# EAGLE design UnoBot (EAGLE 9.6.2)
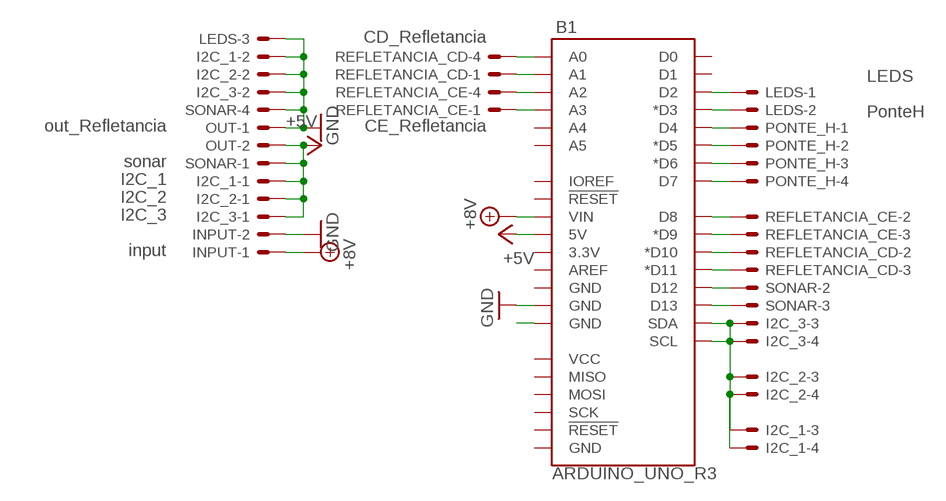
[diagram p0: schematic, sheet 1]

## Parts
B1  ARDUINO_UNO_R3  [ARDUINO_R3]
I2C_1  I2C_1  JST-XH-04-PIN-LONG-PAD  [JST-XH-04-PACKAGE-LONG-PAD]
I2C_2  I2C_2  JST-XH-04-PIN-LONG-PAD  [JST-XH-04-PACKAGE-LONG-PAD]
I2C_3  I2C_3  JST-XH-04-PIN-LONG-PAD  [JST-XH-04-PACKAGE-LONG-PAD]
INPUT  input  JST-XH-02-PIN-LONG-PAD  [JST-XH-02-PACKAGE-LONG-PAD]
LEDS  LEDS  JST-XH-03-PIN-LONG-PAD  [JST-XH-03-PACKAGE-LONG-PAD]
OUT  out_Refletancia  JST-XH-02-PIN-LONG-PAD  [JST-XH-02-PACKAGE-LONG-PAD]
PONTE_H  PonteH  JST-XH-04-PIN-LONG-PAD  [JST-XH-04-PACKAGE-LONG-PAD]
REFLETANCIA_CD  CD_Refletancia  JST-XH-04-PIN-LONG-PAD  [JST-XH-04-PACKAGE-LONG-PAD]
REFLETANCIA_CE  CE_Refletancia  JST-XH-04-PIN-LONG-PAD  [JST-XH-04-PACKAGE-LONG-PAD]
SONAR  sonar  JST-XH-04-PIN-LONG-PAD  [JST-XH-04-PACKAGE-LONG-PAD]

## Nets
+5V: B1.5V I2C_1.1 I2C_2.1 I2C_3.1 OUT.2 SONAR.1
+8V: B1.VIN INPUT.1
GND: B1.GND@3(GND) I2C_1.2 I2C_2.2 I2C_3.2 INPUT.2 LEDS.3 OUT.1 SONAR.4
N$1: B1.D4 PONTE_H.1
N$2: B1.D5(*D5) PONTE_H.2
N$3: B1.D6(*D6) PONTE_H.3
N$4: B1.D7 PONTE_H.4
N$5: B1.A0 REFLETANCIA_CD.4
N$6: B1.A1 REFLETANCIA_CD.1
N$7: B1.A2 REFLETANCIA_CE.4
N$8: B1.A3 REFLETANCIA_CE.1
N$9: B1.D8 REFLETANCIA_CE.2
N$10: B1.D9(*D9) REFLETANCIA_CE.3
N$11: B1.D10(*D10) REFLETANCIA_CD.2
N$12: B1.D11(*D11) REFLETANCIA_CD.3
N$13: B1.D13 SONAR.3
N$14: B1.SDA I2C_1.3 I2C_2.3 I2C_3.3
N$15: B1.D12 SONAR.2
N$16: B1.SCL I2C_1.4 I2C_2.4 I2C_3.4
N$17: B1.GND@2(GND)
N$18: B1.D2 LEDS.1
N$19: B1.D3(*D3) LEDS.2
Unconnected: B1.3.3V B1.A4 B1.A5 B1.AREF B1.D0 B1.D1 B1.GND@1(GND) B1.GND@4(GND) B1.IOREF B1.MISO B1.MOSI B1.RESET@1(!RESET!) B1.RESET@2(!RESET!) B1.SCK B1.VCC

## Library data of the parts
B1 = SparkFun-Boards:ARDUINO_UNO_R3: Arduino R3 Footprint with SPI header Arduino Uno R3 Compatible Footprint. Matches PCB size of the original board. SparkFun Products: SAMD21 Dev Breakout <https://www.sparkfun.com/products/13672> RedBoard <https://www.sparkfun.com/products/12757> R3 Stackable Headers <https://www.sparkfun.com/products/11417>
I2C_1-I2C_3 PONTE_H REFLETANCIA_CD REFLETANCIA_CE SONAR = Rembrandt Electronics - JST XH Connectors v1-0:JST-XH-04-PIN: JST XH Connector 2 Pin Wire to board connector. Pitch: 2,54 mm, (0.100") Number of pins: 4 Created by Rembrandt Electronics www.rembrandtelectronics.com
INPUT OUT = Rembrandt Electronics - JST XH Connectors v1-0:JST-XH-02-PIN: JST XH Connector 2 Pin Wire to board connector. Pitch: 2,54 mm, (0.100") Number of pins: 2 Created by Rembrandt Electronics www.rembrandtelectronics.com
LEDS = Rembrandt Electronics - JST XH Connectors v1-0:JST-XH-03-PIN: JST XH Connector 2 Pin Wire to board connector. Pitch: 2,54 mm, (0.100") Number of pins: 3 Created by Rembrandt Electronics www.rembrandtelectronics.com

## Board
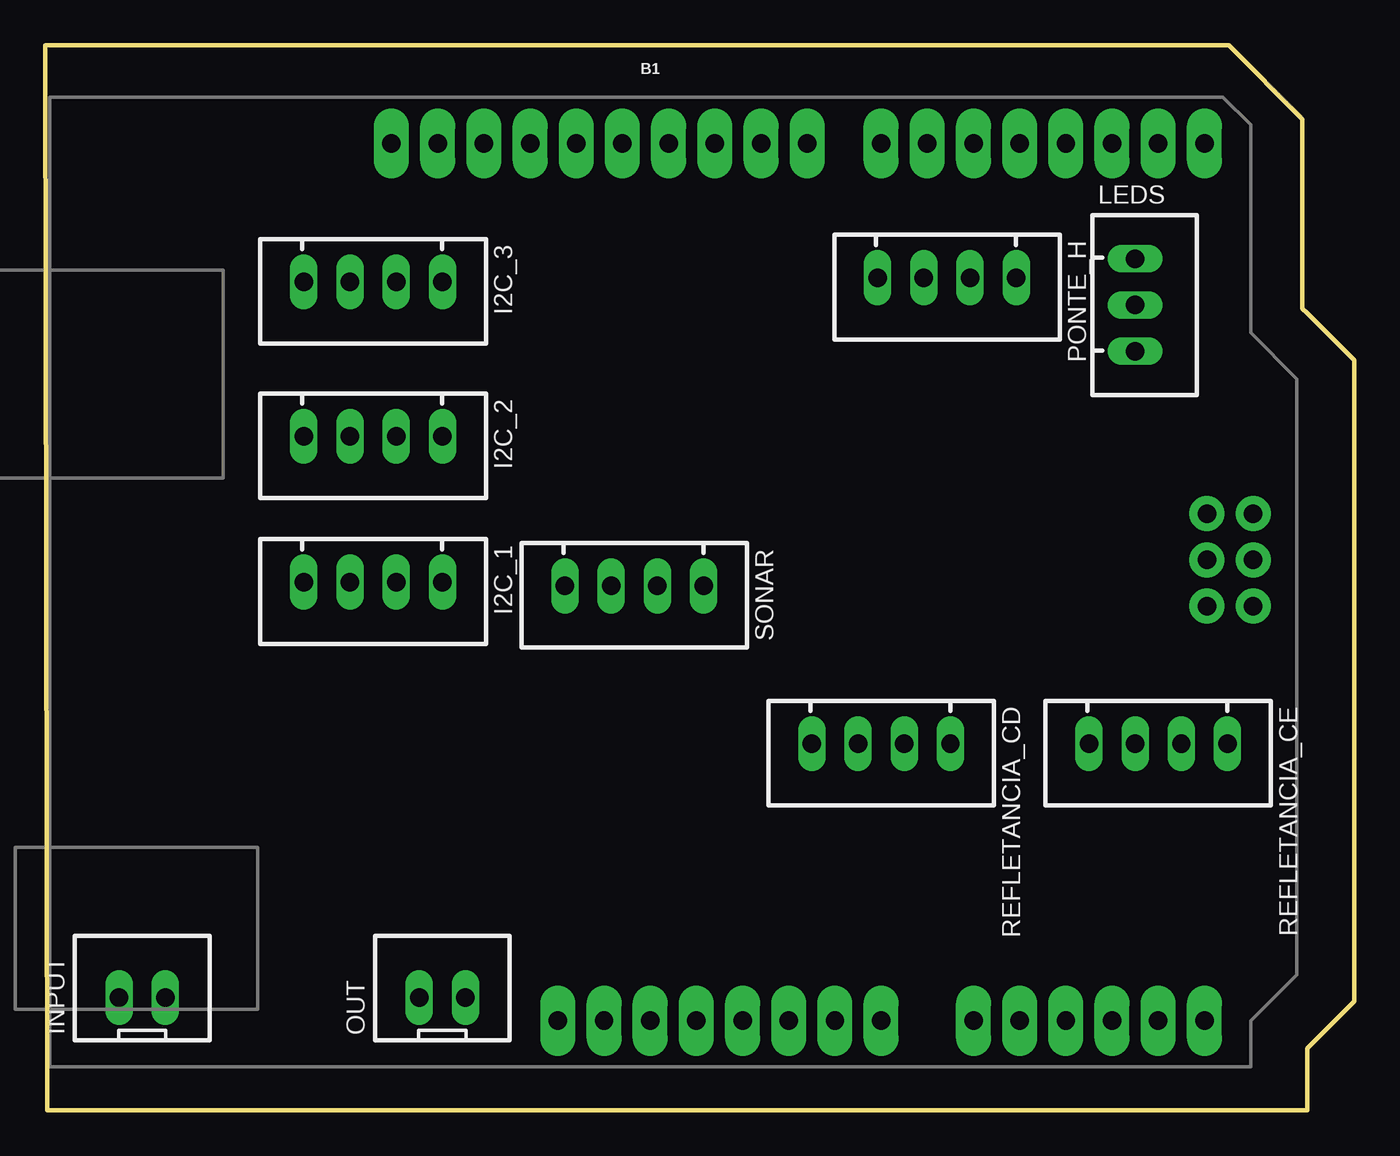
[diagram p1: board, top side]
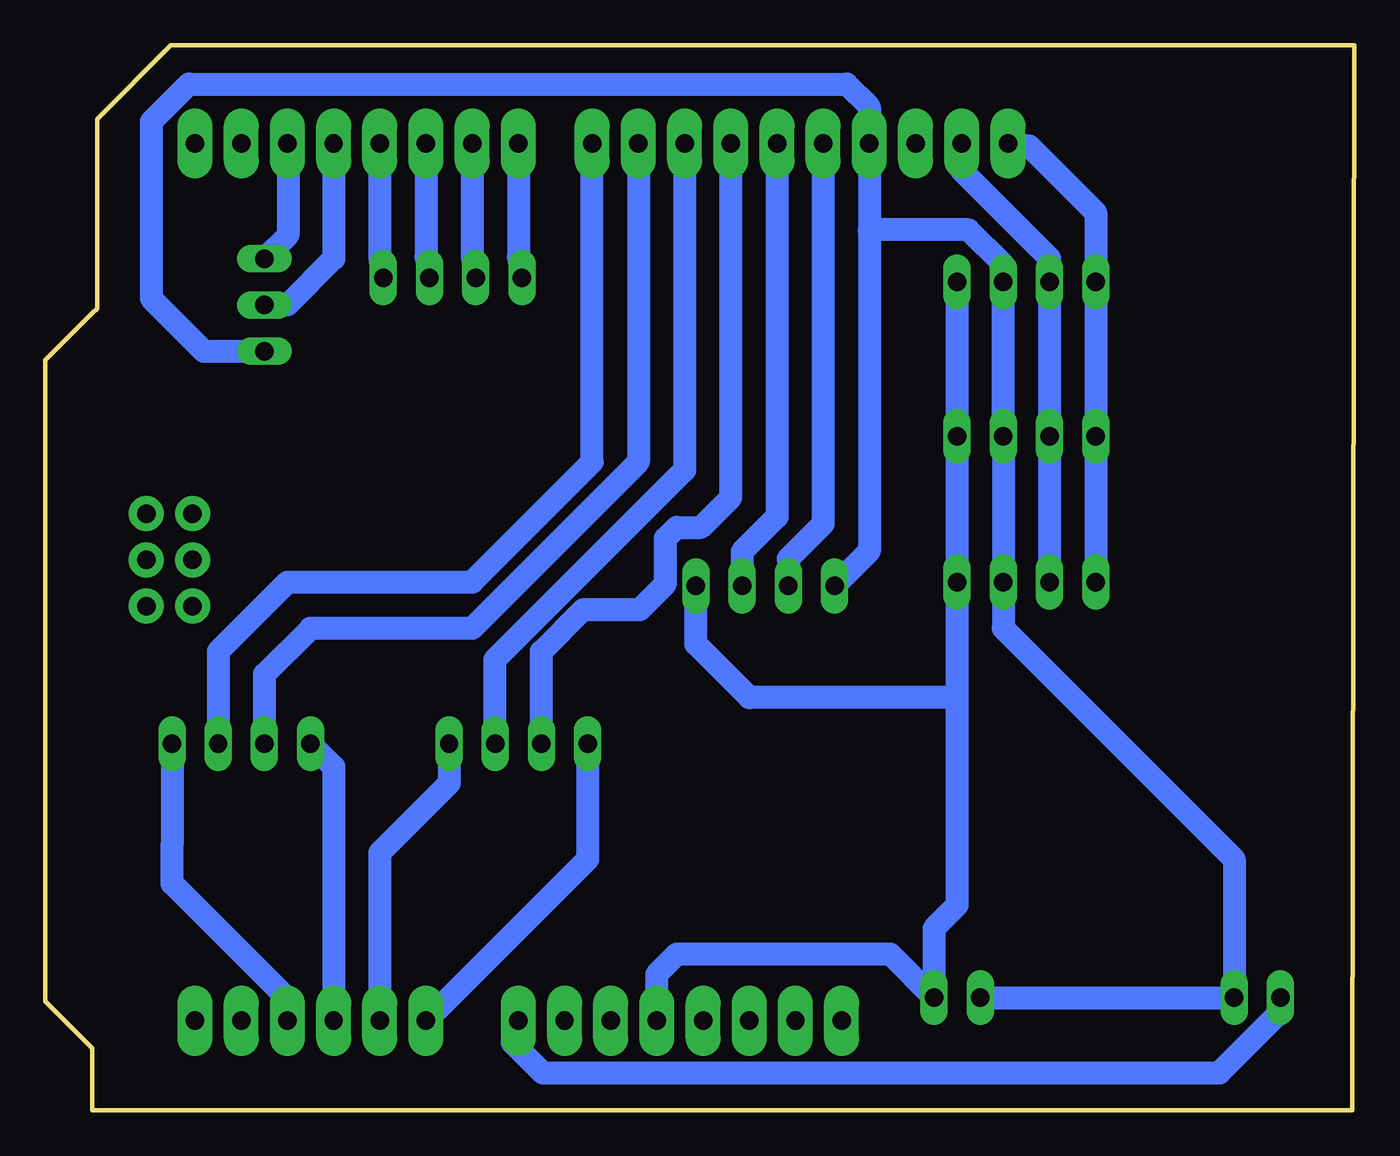
[diagram p2: board, bottom side, seen from below]

Size 71.97 x 58.57 mm. Coordinates in mm from the lower left corner, seen from the top.
Outline: 0.01,58.57 0,58.57
Outline: 0,58.57 65.07,58.57 69.13,54.52 69.13,44.11 69.39,43.84 71.97,41.26 71.97,5.99 69.39,3.42 69.39,3.25 69.39,0.01 68.76,0 0.99,0
Outline: 0.99,0 0.14,0
Outline: 0,58.57 0.1,0 0.99,0
Copper layers (1*16): Top 0.035mm / dielectric 1.5mm / Bottom 0.035mm
Design rules "default": minimum track width 6mil, minimum drill 0.35mm, track to track 6mil, track to pad 6mil, pad to pad 6mil, via to via 6mil, smd to smd 6mil, copper to edge 40mil, drill to drill 6mil, minimum pad ring 10mil, minimum via ring 8mil, stop-mask expansion 4mil, vias tented up to drill 0mil, thermal gap 10mil

### Footprints (pad centres in the part's own frame; a part is rotated, then mirrored left to right if it is on the bottom)
ARDUINO_R3 = drill 1.016 pad 1.93 long: 3.3V 2.54,-24.13; 5V 5.08,-24.13; A0 17.78,-24.13; A1 20.32,-24.13; A2 22.86,-24.13; A3 25.4,-24.13; A4 27.94,-24.13; A5 30.48,-24.13; AREF -9.144,24.13; D0 30.48,24.13; D1 27.94,24.13; D2 25.4,24.13; D3 22.86,24.13; D4 20.32,24.13; D5 17.78,24.13; D6 15.24,24.13; D7 12.7,24.13; D8 8.636,24.13; D9 6.096,24.13; D10 3.556,24.13; D11 1.016,24.13; D12 -1.524,24.13; D13 -4.064,24.13; GND@1 7.62,-24.13; GND@2 10.16,-24.13; GND@3 -6.604,24.13; IOREF -2.54,-24.13; NC -5.08,-24.13; RESET@1 0,-24.13; SCL -14.224,24.13; SDA -11.684,24.13; VIN 12.7,-24.13 | drill 1.016 pad 1.93: GND@4 33.16,-1.32; MISO 30.62,3.76; MOSI 33.16,1.22; RESET@2 30.62,-1.32; SCK 30.62,1.22; VCC 33.16,3.76
JST-XH-04-PACKAGE-LONG-PAD = drill 1.016 long: 1 -3.81,0; 2 -1.27,0; 3 1.27,0; 4 3.81,0
JST-XH-02-PACKAGE-LONG-PAD = drill 1.016 long: 1 -1.27,0; 2 1.27,0
JST-XH-03-PACKAGE-LONG-PAD = drill 1.016 long: 1 -2.54,0; 2 0,0; 3 2.54,0

### Placement (x,y rotation side)
B1  33.26,29.06 0 top
I2C_1  18.02,29.06 180 top
I2C_2  18.02,37.07 180 top
I2C_3  18.02,45.57 180 top
INPUT  5.32,6.2 0 top
LEDS  59.93,44.3 270 top
OUT  21.83,6.2 0 top
PONTE_H  49.58,45.8 180 top
REFLETANCIA_CD  45.96,20.17 180 top
REFLETANCIA_CE  61.2,20.17 180 top
SONAR  32.38,28.84 180 top

### Tracks (layer width: path | path; a pad name or v marks a point on that pad's centre or on a via)
+5V
  Bottom 1.27: I2C_3.1 I2C_2.1 I2C_1.1 21.83,22.71 | 21.83,22.71 33.26,22.71 36.2,25.64 SONAR.1 | B1.5V 38.34,7.47 38.35,7.48 37.24,8.6 25.5,8.6 OUT.2 23.1,10.01 21.83,11.28 21.83,22.71
+8V
  Bottom 1.27: B1.VIN 45.96,4.25 46.29,3.72 44.63,2.06 7.4,2.06 4.05,5.41 INPUT.1
GND
  Bottom 1.27: OUT.1 INPUT.2 6.59,13.82 19.29,26.52 I2C_1.2 I2C_2.2 I2C_3.2 19.29,46.53 21.2,48.44 26.61,48.44 26.66,48.39 | LEDS.3 63.26,41.76 66.15,44.65 66.15,54.38 64.08,56.45 27.91,56.45 26.66,55.2 B1.GND@3 26.66,48.39 | SONAR.4 26.66,30.76 26.66,48.39
N$1
  Bottom 1.27: B1.D4 53.58,46.94 PONTE_H.1
N$2
  Bottom 1.27: B1.D5 51.04,46.94 PONTE_H.2
N$3
  Bottom 1.27: B1.D6 48.5,46.94 PONTE_H.3
N$4
  Bottom 1.27: B1.D7 45.96,46.94 PONTE_H.4
N$5
  Bottom 1.27: REFLETANCIA_CD.4 42.15,13.82 B1.A0
N$6
  Bottom 1.27: REFLETANCIA_CD.1 49.77,17.98 53.58,14.17 B1.A1
N$7
  Bottom 1.27: REFLETANCIA_CE.4 56.12,18.9 B1.A2
N$8
  Bottom 1.27: REFLETANCIA_CE.1 65.01,14.59 65.01,12.48 58.66,6.13 B1.A3
N$9
  Bottom 1.27: REFLETANCIA_CE.2 62.47,25.25 58.66,29.06 48.5,29.06 41.9,35.66 B1.D8
N$10
  Bottom 1.27: REFLETANCIA_CE.3 59.93,23.98 57.39,26.52 48.5,26.52 39.36,35.66 B1.D9
N$11
  Bottom 1.27: B1.D10 36.82,35.22 47.26,24.78 47.26,20.19 REFLETANCIA_CD.2
N$12
  Bottom 1.27: REFLETANCIA_CD.3 44.69,25.25 42.39,27.55 39.28,27.55 37.87,28.96 37.87,31.46 37.26,32.07 35.93,32.07 34.28,33.72 B1.D11
N$13
  Bottom 1.27: SONAR.3 31.12,30.34 29.2,32.26 B1.D13
N$14
  Bottom 1.27: I2C_1.3 I2C_2.3 I2C_3.3 16.75,46.86 21.62,51.73 21.62,52.21 21.58,52.25 B1.SDA
N$15
  Bottom 1.27: SONAR.2 33.66,30.73 31.74,32.65 B1.D12
N$16
  Bottom 1.27: B1.SCL 17.88,53.05 14.21,49.38 I2C_3.4 I2C_2.4 I2C_1.4
N$18
  Bottom 1.27: B1.D2 58.62,53.15 58.62,48.15 LEDS.1
N$19
  Bottom 1.27: B1.D3 56.12,51.92 56.12,46.84 58.66,44.3 LEDS.2